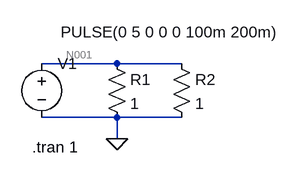
[diagram p0: schematic Draft8.asc]
Draft8.asc, the LTspice schematic file:
Version 4
SHEET 1 880 680
WIRE 176 112 64 112
WIRE 272 112 176 112
WIRE 176 192 64 192
WIRE 272 192 176 192
WIRE 176 224 176 192
FLAG 176 224 0
SYMBOL voltage 64 96 R0
WINDOW 3 28 -31 Left 2
WINDOW 123 0 0 Left 0
WINDOW 39 0 0 Left 0
SYMATTR InstName V1
SYMATTR Value PULSE(0 5 0 0 0 100m 200m)
SYMBOL res 160 96 R0
SYMATTR InstName R1
SYMATTR Value 1
SYMBOL res 256 96 R0
SYMATTR InstName R2
SYMATTR Value 1
TEXT 50 236 Left 2 !.tran 1

The netlist it stands for:
* Draft8.asc
V1 N001 0 PULSE(0 5 0 0 0 100m 200m)
R1 N001 0 1
R2 N001 0 1
.tran 1
.backanno
.end

* Results of the author's LTspice run, read from the files saved beside the schematic
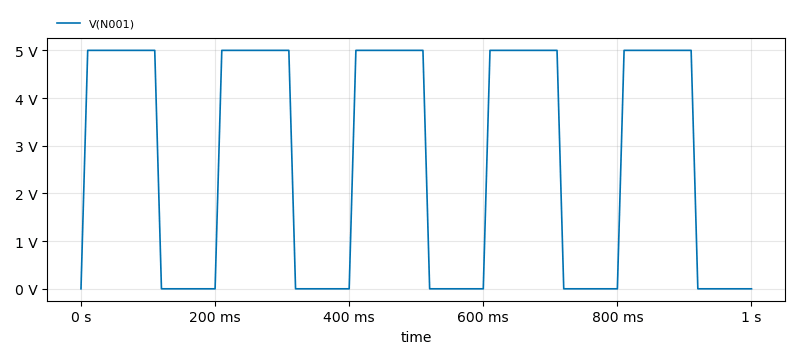
[diagram p1: Transient Analysis of Draft8.asc, plotted from the saved traces]
* Transient Analysis, 1 run:
*   V(N001): min 0 V, max 5 V, average 2.75 V, rms 3.708 V, last 0 V